# Altium schematic sheet MB694.SchDoc
size A4; Revision: A.1(PCB.SCH)
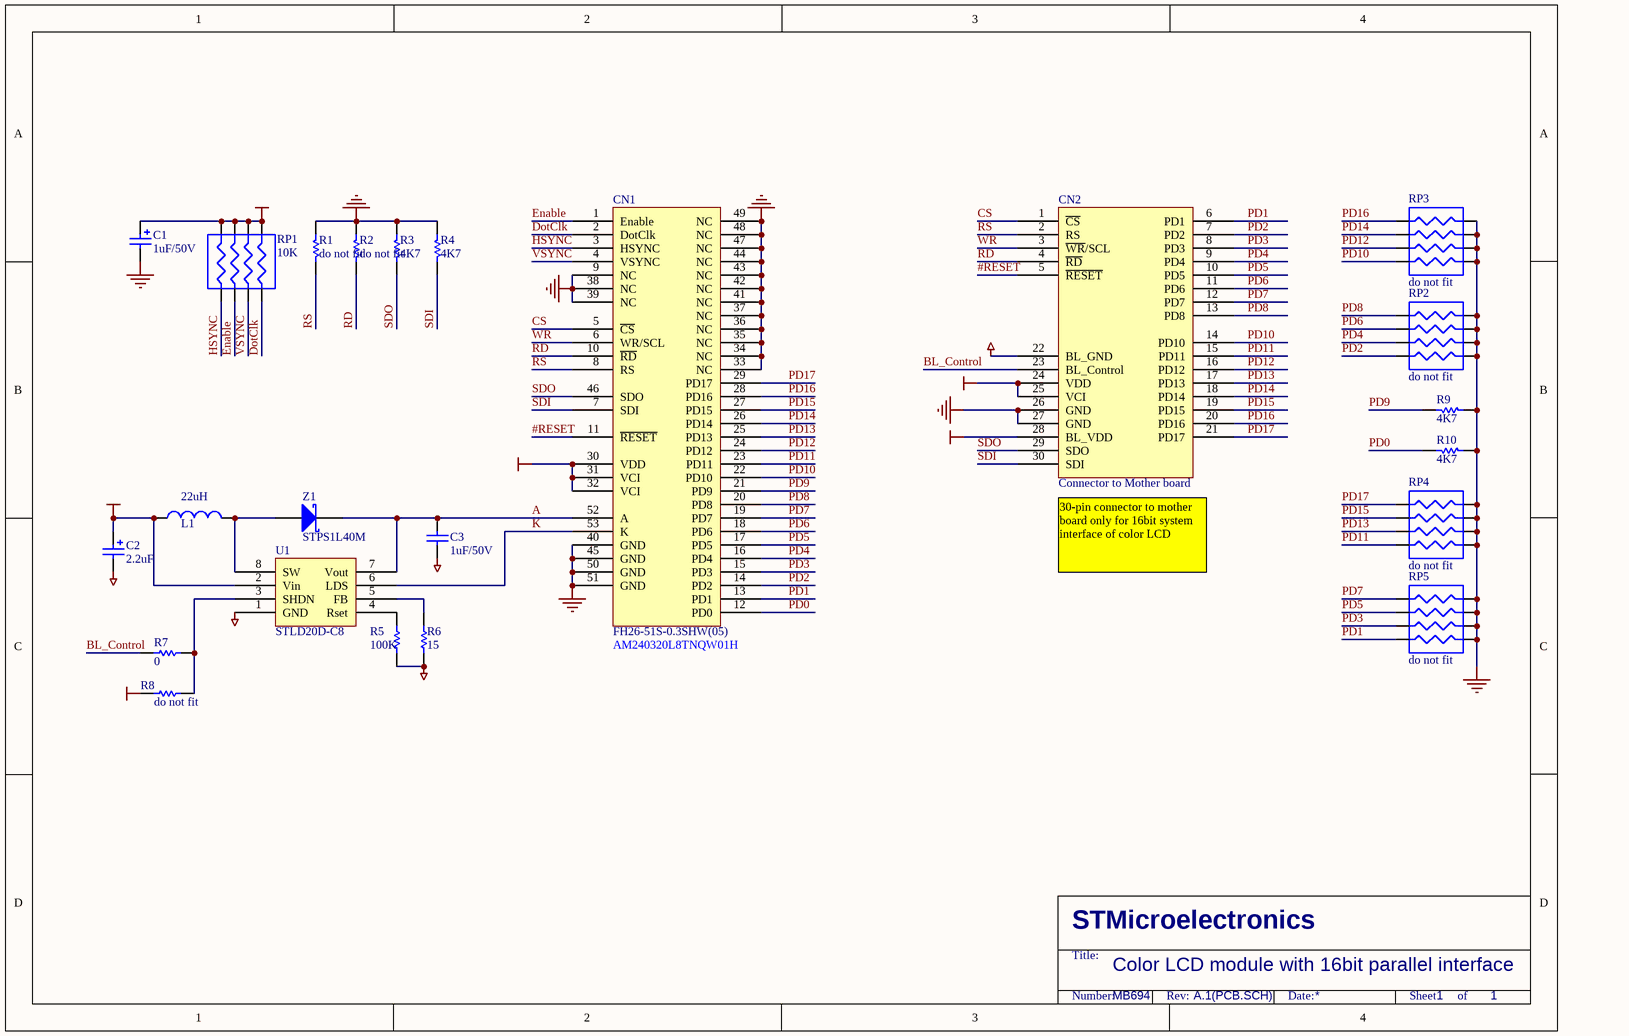
[diagram p0: MB694.SchDoc]

## Parts
C1  1uF/50V  [TAN-B]
C2  2.2uF  [TAN-A]
C3  1uF/50V  [0603]
CN1  FH26-51S-0.3SHW(05)
CN2  Connector to Mother board  [AM240320A]
L1  22uH  [3225]
R1  do not fit  [0603]
R2  do not fit  [0603]
R3  4K7  [0603]
R4  4K7  [0603]
R5  100K  [0603]
R6  15  [0603]
R7  0  [0603]
R8  do not fit  [0603]
R9  4K7  [0603]
R10  4K7  [0603]
RP1  10K  [RES-4B]
RP2  do not fit  [RES-4B]
RP3  do not fit  [RES-4B]
RP4  do not fit  [RES-4B]
RP5  do not fit  [RES-4B]
U1  STLD20D-C8  [SOT23-8L]
Z1  STPS1L40M  [1R1C]

## Nets
BLGND: C2.2 C3.1 CN2.22(BL_GND) R5.1 R6.1 U1.1(GND)
BLVDD: C2.1 CN2.28(BL_VDD) L1.1 R8.2 U1.2(Vin)
GND: C1.2 CN1.9(NC) CN1.33(NC) CN1.34(NC) CN1.35(NC) CN1.36(NC) CN1.37(NC) CN1.38(NC) CN1.39(NC) CN1.40(GND) CN1.41(NC) CN1.42(NC) CN1.43(NC) CN1.44(NC) CN1.45(GND) CN1.47(NC) CN1.48(NC) CN1.49(NC) CN1.50(GND) CN1.51(GND) CN2.26(GND) CN2.27(GND) R1.1 R2.1 R3.1 R4.1 R9.1 R10.1 RP2.2(R1) RP2.4(R3) RP2.6(R2) RP2.8(R0) RP3.2(R1) RP3.4(R3) RP3.6(R2) RP3.8(R0) RP4.2(R1) RP4.4(R3) RP4.6(R2) RP4.8(R0) RP5.2(R1) RP5.4(R3) RP5.6(R2) RP5.8(R0)
VDD: C1.1 CN1.30(VDD) CN1.31(VCI) CN1.32(VCI) CN2.24(VDD) CN2.25(VCI) RP1.2(R1) RP1.4(R3) RP1.6(R2) RP1.8(R0)
#RESET: CN1.11(~{RESET}) CN2.5(~{RESET})
A: C3.2 CN1.52(A) U1.7(Vout) Z1.2(K)
BL_Control: CN2.23(BL_Control) R7.2
CS: CN1.5(~{CS}) CN2.1(~{CS})
DotClk: CN1.2(DotClk) RP1.7(R1)
Enable: CN1.1(Enable) RP1.3(R2)
HSYNC: CN1.3(HSYNC) RP1.1(R0)
K: CN1.53(K) U1.6(LDS)
PD0: CN1.12(PD0) R10.2
PD1: CN1.13(PD1) CN2.6(PD1) RP5.7(R1)
PD2: CN1.14(PD2) CN2.7(PD2) RP2.7(R1)
PD3: CN1.15(PD3) CN2.8(PD3) RP5.5(R3)
PD4: CN1.16(PD4) CN2.9(PD4) RP2.5(R3)
PD5: CN1.17(PD5) CN2.10(PD5) RP5.3(R2)
PD6: CN1.18(PD6) CN2.11(PD6) RP2.3(R2)
PD7: CN1.19(PD7) CN2.12(PD7) RP5.1(R0)
PD8: CN1.20(PD8) CN2.13(PD8) RP2.1(R0)
PD9: CN1.21(PD9) R9.2
PD10: CN1.22(PD10) CN2.14(PD10) RP3.7(R1)
PD11: CN1.23(PD11) CN2.15(PD11) RP4.7(R1)
PD12: CN1.24(PD12) CN2.16(PD12) RP3.5(R3)
PD13: CN1.25(PD13) CN2.17(PD13) RP4.5(R3)
PD14: CN1.26(PD14) CN2.18(PD14) RP3.3(R2)
PD15: CN1.27(PD15) CN2.19(PD15) RP4.3(R2)
PD16: CN1.28(PD16) CN2.20(PD16) RP3.1(R0)
PD17: CN1.29(PD17) CN2.21(PD17) RP4.1(R0)
RD: CN1.10(~{RD}) CN2.4(~{RD}) R2.2
RS: CN1.8(RS) CN2.2(RS) R1.2
SDI: CN1.7(SDI) CN2.30(SDI) R4.2
SDO: CN1.46(SDO) CN2.29(SDO) R3.2
VSYNC: CN1.4(VSYNC) RP1.5(R3)
WR: CN1.6(WR/SCL) CN2.3(~{WR}/SCL)
NetL1_2: L1.2 U1.8(SW) Z1.1(A)
NetR5_2: R5.2 U1.4(Rset)
NetR6_2: R6.2 U1.5(FB)
NetR7_1: R7.1 R8.1 U1.3(SHDN)

## Notes on the sheet
- (near CN2) 30-pin connector to mother board only for 16bit system interface of color LCD
- (near CN1) AM240320L8TNQW01H
- Color LCD module with 16bit parallel interface
- MB694
- 1
- STMicroelectronics
- Title:
- Number:
- Rev:
- Date:
- Sheet       of

## Library data of the parts
C1 C2 = Cap Pol1: Polarized Capacitor (Radial); Value: 100pF; Published: 8-Jun-2000; Revision: July-2002: Re-released for DXP Platform.; Publisher: Altium Limited
C3 = CAP: Capacitor; Value: 100pF; Published: 8-Jun-2000; Revision: July-2002: Re-released for DXP Platform.; Publisher: Altium Limited
CN1 = AM240320LTNQW00H
CN2 = ColorLCD_module
L1 = Inductor: Value: 100uH; Published: 8-Jun-2000; Revision: July-2002: Re-released for DXP Platform.; Publisher: Altium Limited
R1-R10 = Res1: Resistor; Value: 1K; Published: 8-Jun-2000; Revision: July-2002: Re-released for DXP Platform.; Publisher: Altium Limited
RP1-RP5 = RES4B
Z1 = D Schottky: Schottky Diode; Code - JEDEC: DO-214-AA; Published: 8-Jun-2000; Revision: July-2002: Re-released for DXP Platform.; Publisher: Altium Limited